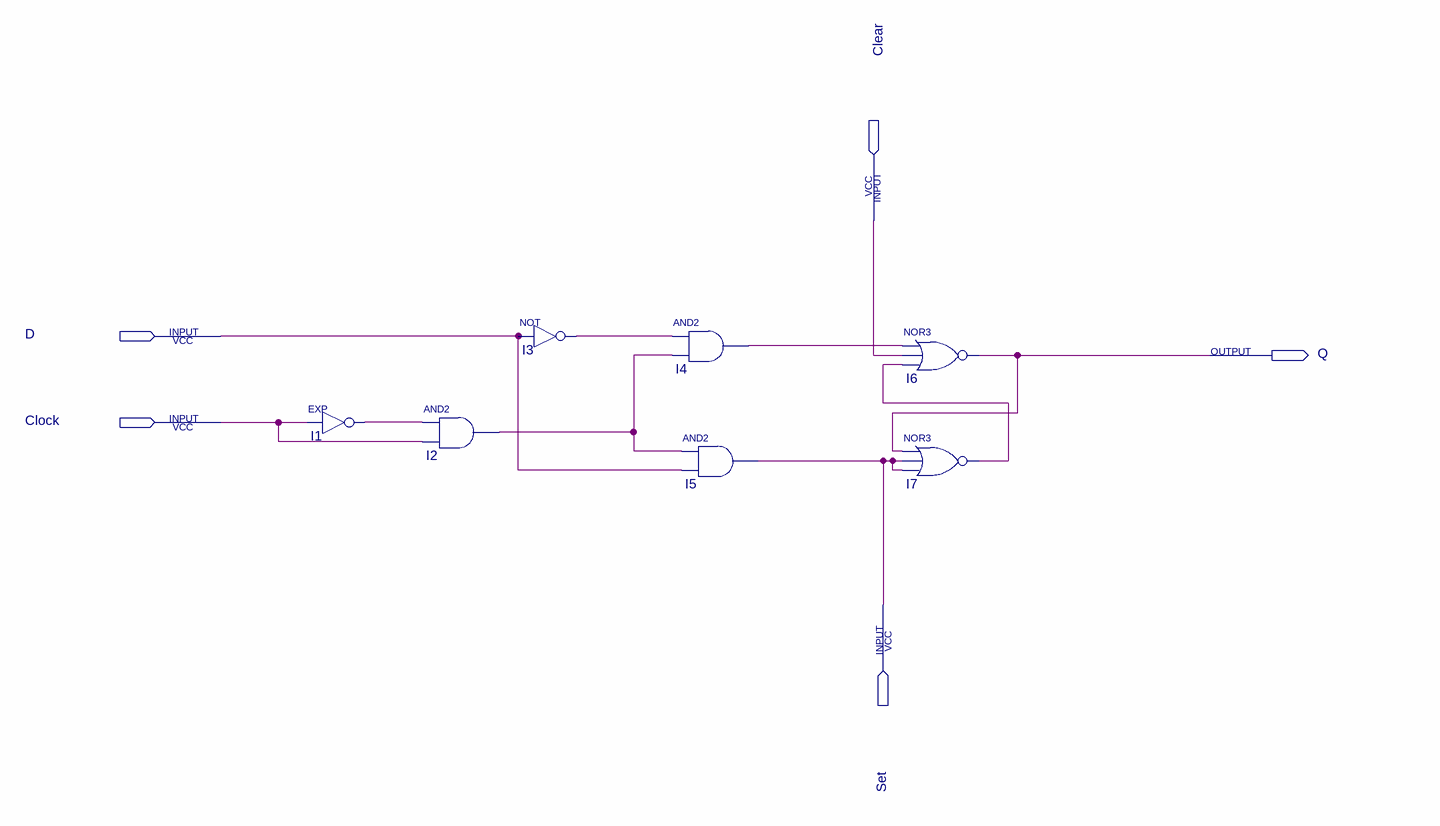
[diagram p0: schematic sheet]
// Quartus schematic FlipFLop-DRS.bdf as structural Verilog: 7 symbols, 5 pins
module \FlipFLop-DRS  (
  input  Clear,
  input  D,
  input  Clock,
  input  Set,
  output Q
);

  wire I1_out, I2_out, I3_out, I4_out, I7_out;

  EXP I1 (.IN(Clock), .OUT(I1_out));
  and I2 (I2_out, I1_out, Clock);
  not I3 (I3_out, D);
  and I4 (I4_out, I3_out, I2_out);
  and I5 (Set, I2_out, D);
  nor I6 (Q, I4_out, Clear, I7_out);
  nor I7 (I7_out, Q, Set, Set);
endmodule
